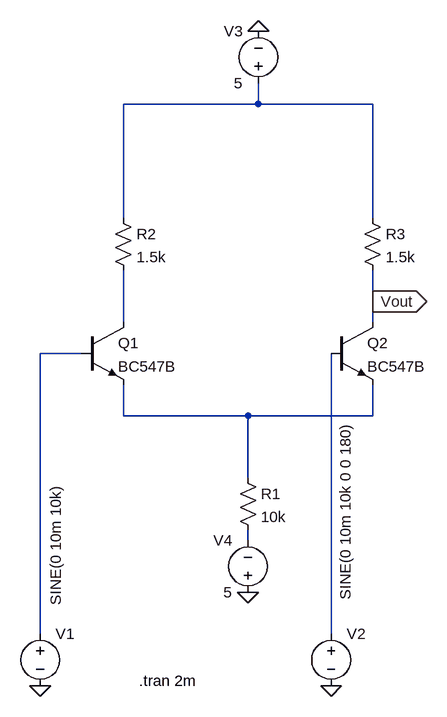
[diagram p0: schematic PreAmp.asc]
PreAmp.asc, the LTspice schematic file:
Version 4
SHEET 1 880 680
WIRE 512 -240 512 -272
WIRE 512 -240 304 -240
WIRE 688 -240 512 -240
WIRE 304 -64 304 -240
WIRE 688 -64 688 -240
WIRE 688 64 688 16
WIRE 304 96 304 16
WIRE 688 96 688 64
WIRE 240 144 176 144
WIRE 304 240 304 192
WIRE 496 240 304 240
WIRE 688 240 688 192
WIRE 688 240 496 240
WIRE 496 336 496 240
WIRE 496 432 496 416
WIRE 176 576 176 144
WIRE 624 576 624 144
FLAG 176 656 0
FLAG 624 656 0
FLAG 688 64 Vout
IOPIN 688 64 Out
FLAG 512 -352 0
FLAG 496 512 0
SYMBOL voltage 176 560 R0
WINDOW 123 0 0 Left 0
WINDOW 39 0 0 Left 0
WINDOW 3 24 -213 VRight 2
SYMATTR Value SINE(0 10m 10k)
SYMATTR InstName V1
SYMBOL npn 240 96 R0
SYMATTR InstName Q1
SYMATTR Value BC547B
SYMBOL npn 624 96 R0
SYMATTR InstName Q2
SYMATTR Value BC547B
SYMBOL res 480 320 R0
SYMATTR InstName R1
SYMATTR Value 10k
SYMBOL res 288 -80 R0
SYMATTR InstName R2
SYMATTR Value 1.5k
SYMBOL res 672 -80 R0
SYMATTR InstName R3
SYMATTR Value 1.5k
SYMBOL voltage 624 560 R0
WINDOW 123 0 0 Left 0
WINDOW 39 0 0 Left 0
WINDOW 3 22 -309 VRight 2
SYMATTR Value SINE(0 10m 10k 0 0 180)
SYMATTR InstName V2
SYMBOL voltage 512 -256 R180
WINDOW 0 24 96 Left 2
WINDOW 3 24 16 Left 2
WINDOW 123 0 0 Left 0
WINDOW 39 0 0 Left 0
SYMATTR InstName V3
SYMATTR Value 5
SYMBOL voltage 496 528 R180
WINDOW 0 24 96 Left 2
WINDOW 3 24 16 Left 2
WINDOW 123 0 0 Left 0
WINDOW 39 0 0 Left 0
SYMATTR InstName V4
SYMATTR Value 5
TEXT 328 648 Left 2 !.tran 2m

The netlist it stands for:
* PreAmp.asc
V1 N003 0 SINE(0 10m 10k)
Q1 N002 N003 N004 0 BC547B
Q2 Vout N006 N004 0 BC547B
R1 N004 N005 10k
R2 N001 N002 1.5k
R3 N001 Vout 1.5k
V2 N006 0 SINE(0 10m 10k 0 0 180)
V3 N001 0 5
V4 0 N005 5
.model NPN NPN
.model PNP PNP
.lib standard.bjt
.tran 2m
.backanno
.end